# Altium schematic sheet Buck-regulator.SchDoc: Buck Regulator
size A4; Address3: Self Checkout Shopping Cart; DocumentNumber: 1; Revision: 1.0; SheetNumber: 3; SheetTotal: 7
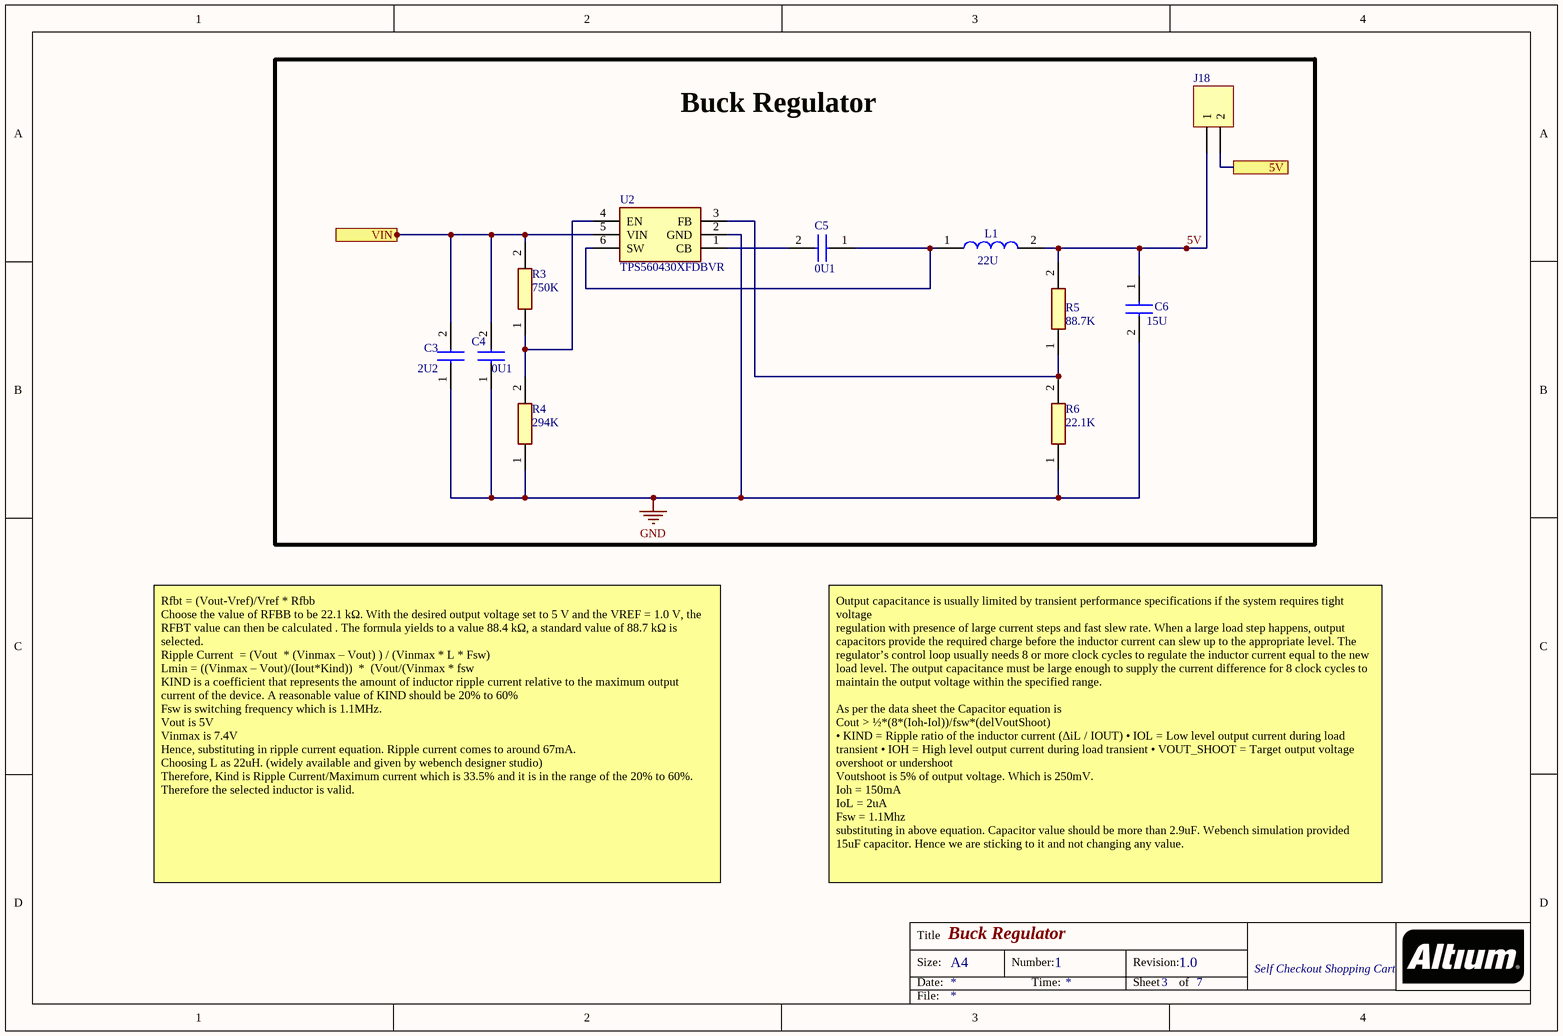
[diagram p0: Buck-regulator.SchDoc]

## Parts
C3  value 2U2  [CAPC2012X145N]  (hidden comment: GRM21BR71C225KA12L)
C4  value 0U1  [CAPC1608X87N]  (hidden comment: C0603C104K4RECTU)
C5  value 0U1  [CAPC1608X87N]  (hidden comment: C0603C104K4RECTU)
C6  value 15U  [CAPC1608X90N]  (hidden comment: GRM1885C2A150JA01D)
J18  Header 2  [HDR1X2]  (value not drawn)
L1  value 22U  [SRN3015]  (hidden comment: SRN3015-220M)
R3  value 750K  [RESC1608X55N]  (hidden comment: CR0603-FX-7503ELF)
R4  value 294K  [RESC1608X55N]  (hidden comment: CR0603-FX-2943ELF)
R5  value 88.7K  [RESC1608X50N]  (hidden comment: CRCW060388K7FKEA)
R6  value 22.1K  [RESC1608X55N]  (hidden comment: RC0603FR-0722K1L)
U2  TPS560430XFDBVR  [SOT95P280X145-6N]

## Blocks framed on the sheet
Buck Regulator: C3-C6 J18 L1 R3-R6 U2

## Ports
5V, VIN

## Nets
GND: C3.1 C4.1 C6.2 R4.1 R6.1 U2.2(GND)
5V: C6.1 J18.1 L1.2 R5.2
5V: J18.2 ; port 5V  [a separate net that carries the same name]
VIN: C3.2 C4.2 R3.2 U2.5(VIN) ; port VIN
NetC5_1: C5.1 L1.1 U2.6(SW)
NetC5_2: C5.2 U2.1(CB)
NetR3_1: R3.1 R4.2 U2.4(EN)
NetR5_1: R5.1 R6.2 U2.3(FB)

## Notes on the sheet
- Rfbt = (Vout-Vref)/Vref * Rfbb
  Choose the value of RFBB to be 22.1 kΩ. With the desired output voltage set to 5 V and the VREF = 1.0 V, the RFBT value can then be calculated . The formula yields to a value 88.4 kΩ, a standard value of 88.7 kΩ is selected.
  Ripple Current  = (Vout  * (Vinmax – Vout) ) / (Vinmax * L * Fsw)
  Lmin = ((Vinmax – Vout)/(Iout*Kind))  *  (Vout/(Vinmax * fsw
  KIND is a coefficient that represents the amount of inductor ripple current relative to the maximum output current of the device. A reasonable value of KIND should be 20% to 60%
  Fsw is switching frequency which is 1.1MHz.
  Vout is 5V
  Vinmax is 7.4V
  Hence, substituting in ripple current equation. Ripple current comes to around 67mA.
  Choosing L as 22uH. (widely available and given by webench designer studio)
  Therefore, Kind is Ripple Current/Maximum current which is 33.5% and it is in the range of the 20% to 60%. Therefore the selected inductor is valid.
- Output capacitance is usually limited by transient performance specifications if the system requires tight voltage
  regulation with presence of large current steps and fast slew rate. When a large load step happens, output
  capacitors provide the required charge before the inductor current can slew up to the appropriate level. The
  regulator’s control loop usually needs 8 or more clock cycles to regulate the inductor current equal to the new
  load level. The output capacitance must be large enough to supply the current difference for 8 clock cycles to
  maintain the output voltage within the specified range.
  As per the data sheet the Capacitor equation is
  Cout > ½*(8*(Ioh-Iol))/fsw*(delVoutShoot)
  • KIND = Ripple ratio of the inductor current (ΔiL / IOUT) • IOL = Low level output current during load transient • IOH = High level output current during load transient • VOUT_SHOOT = Target output voltage overshoot or undershoot
  Voutshoot is 5% of output voltage. Which is 250mV.
  Ioh = 150mA
  IoL = 2uA
  Fsw = 1.1Mhz
  substituting in above equation. Capacitor value should be more than 2.9uF. Webench simulation provided 15uF capacitor. Hence we are sticking to it and not changing any value.
- Title
- Size:
- Date:
- A4
- Number:
- Time:
- Revision:
- Sheet
- of
- File:

## Library data of the parts
C3 = GRM21BR71C225KA12L: Capacitor; Manufacturer_Name: Murata Electronics; Datasheet Link: http://www.murata.com/~/media/webrenewal/support/library/catalog/products/capacitor/mlcc/c02e.pdf; Height: 1.45mm; Manufacturer_Part_Number: GRM21BR71C225KA12L; Mouser Part Number: 81-GRM21BR71C225KA2L; Mouser Price/Stock: https://www.mouser.com/Search/Refine.aspx?Keyword=81-GRM21BR71C225KA2L; RS Part Number: 7236076; RS Price/Stock: https://uk.rs-online.com/web/p/products/7236076
C4 C5 = C0603C104K4RECTU: Capacitor; Manufacturer_Name: Kemet; Datasheet Link: https://api.kemet.com/component-edge/download/datasheet/C0603C104K4RECTU.pdf; Height: 0.87mm; Manufacturer_Part_Number: C0603C104K4RECTU; Mouser Part Number: 80-C0603C104K4RECTU; Mouser Price/Stock: https://www.mouser.com/Search/Refine.aspx?Keyword=80-C0603C104K4RECTU
C6 = GRM1885C2A150JA01D: Capacitor; Manufacturer_Name: Murata Electronics; Datasheet Link: http://www.murata.com/~/media/webrenewal/support/library/catalog/products/capacitor/mlcc/c02e.pdf; Height: 0.9mm; Manufacturer_Part_Number: GRM1885C2A150JA01D; Mouser Part Number: 81-GRM1885C2A150JA01; Mouser Price/Stock: https://www.mouser.com/Search/Refine.aspx?Keyword=81-GRM1885C2A150JA01; RS Part Number: 8151516; RS Price/Stock: https://uk.rs-online.com/web/p/products/8151516
J18 = Header 2: Header, 2-Pin; Manufacturer_Part_Number: BG301-04-A-0540-L-B; Manufacturer_Name: Global Connector Technology; Digi-Key Part Number: 2073-BG301-02-A-0540-L-BCT-ND; Value: *; Digikey Price/Stock: https://www.digikey.com/product-detail/en/gct/BG301-04-A-0540-L-B/2073-BG301-04-A-0540-L-BCT-ND/9859670?utm_source=snapeda&utm_medium=aggregator&utm_campaign=symbol
L1 = SRN3015-220M: Inductor; Manufacturer_Name: Bourns; Allied_Number: 70231649; Manufacturer_Part_Number: SRN3015-220M; Digi-Key Part Number: SRN3015-220MCT-ND; Digikey Price/Stock: https://www.digikey.com/products/en/inductors-coils-chokes/fixed-inductors/71?k=SRN3015-220M&k=&pkeyword=SRN3015-220M&sv=0&pv7=2&sf=0&quantity=&ColumnSort=0&page=1&pageSize=25; RS Part Number: 7435087P; RS Price/Stock: http://uk.rs-online.com/web/p/products/7435087P; Allied Price/Stock: https://www.alliedelec.com/bourns-srn3015-220m/70231649/
R3 = CR0603-FX-7503ELF: Resistor; Manufacturer_Name: Bourns; Datasheet Link: https://www.bourns.com/pdfs/chpreztr.pdf; Height: 0.55mm; Manufacturer_Part_Number: CR0603-FX-7503ELF; Mouser Part Number: 652-CR0603FX-7503ELF; Mouser Price/Stock: https://www.mouser.com/Search/Refine.aspx?Keyword=652-CR0603FX-7503ELF
R4 = CR0603-FX-2943ELF: Resistor; Manufacturer_Name: Bourns; Datasheet Link: https://www.bourns.com/pdfs/chpreztr.pdf; Height: 0.55mm; Manufacturer_Part_Number: CR0603-FX-2943ELF; Mouser Part Number: 652-CR0603FX-2943ELF; Mouser Price/Stock: https://www.mouser.com/Search/Refine.aspx?Keyword=652-CR0603FX-2943ELF
R5 = CRCW060388K7FKEA: Resistor; Manufacturer_Name: Vishay; Allied_Number: 70203516; Datasheet Link: http://www.vishay.com/docs/20035/dcrcwe3.pdf; Height: 0.5mm; Manufacturer_Part_Number: CRCW060388K7FKEA; Mouser Part Number: 71-CRCW0603-88.7K-E3; RS Part Number: 8306693; RS Price/Stock: https://uk.rs-online.com/web/p/products/8306693; Allied Price/Stock: https://www.alliedelec.com/vishay-dale-crcw060388k7fkea/70203516/; Mouser Price/Stock: https://www.mouser.com/ProductDetail/Vishay-Dale/CRCW060388K7FKEA?qs=sGAEpiMZZMu61qfTUdNhG%2Fy1ga03FwuGzQj1%2FlSzSQI%3D
R6 = RC0603FR-0722K1L: Resistor; Manufacturer_Name: YAGEO (PHYCOMP); Datasheet Link: http://www.yageo.com/documents/recent/PYu-RC0603_51_RoHS_L_v5.pdf; Height: 0.55mm; Manufacturer_Part_Number: RC0603FR-0722K1L; Mouser Part Number: 603-RC0603FR-0722K1L; Mouser Price/Stock: https://www.mouser.com/Search/Refine.aspx?Keyword=603-RC0603FR-0722K1L
U2 = TPS560430XFDBVR: Integrated Circuit; Manufacturer_Name: Texas Instruments; Datasheet Link: http://www.ti.com/lit/ds/symlink/tps560430.pdf; Height: 1.45mm; Manufacturer_Part_Number: TPS560430XFDBVR; Mouser Part Number: 595-TPS560430XFDBVR; Mouser Price/Stock: https://www.mouser.com/Search/Refine.aspx?Keyword=595-TPS560430XFDBVR